# EasyEDA Pro project final.epro

# Schematic final
Board Name: final; Create Date: 2025-06-27; Page Name: P1; Project Name: mousring; Schematic Name: final; Update Date: 2025-06-27; Company: EasyEDA.com; Page Size: A4; Version: V1.0
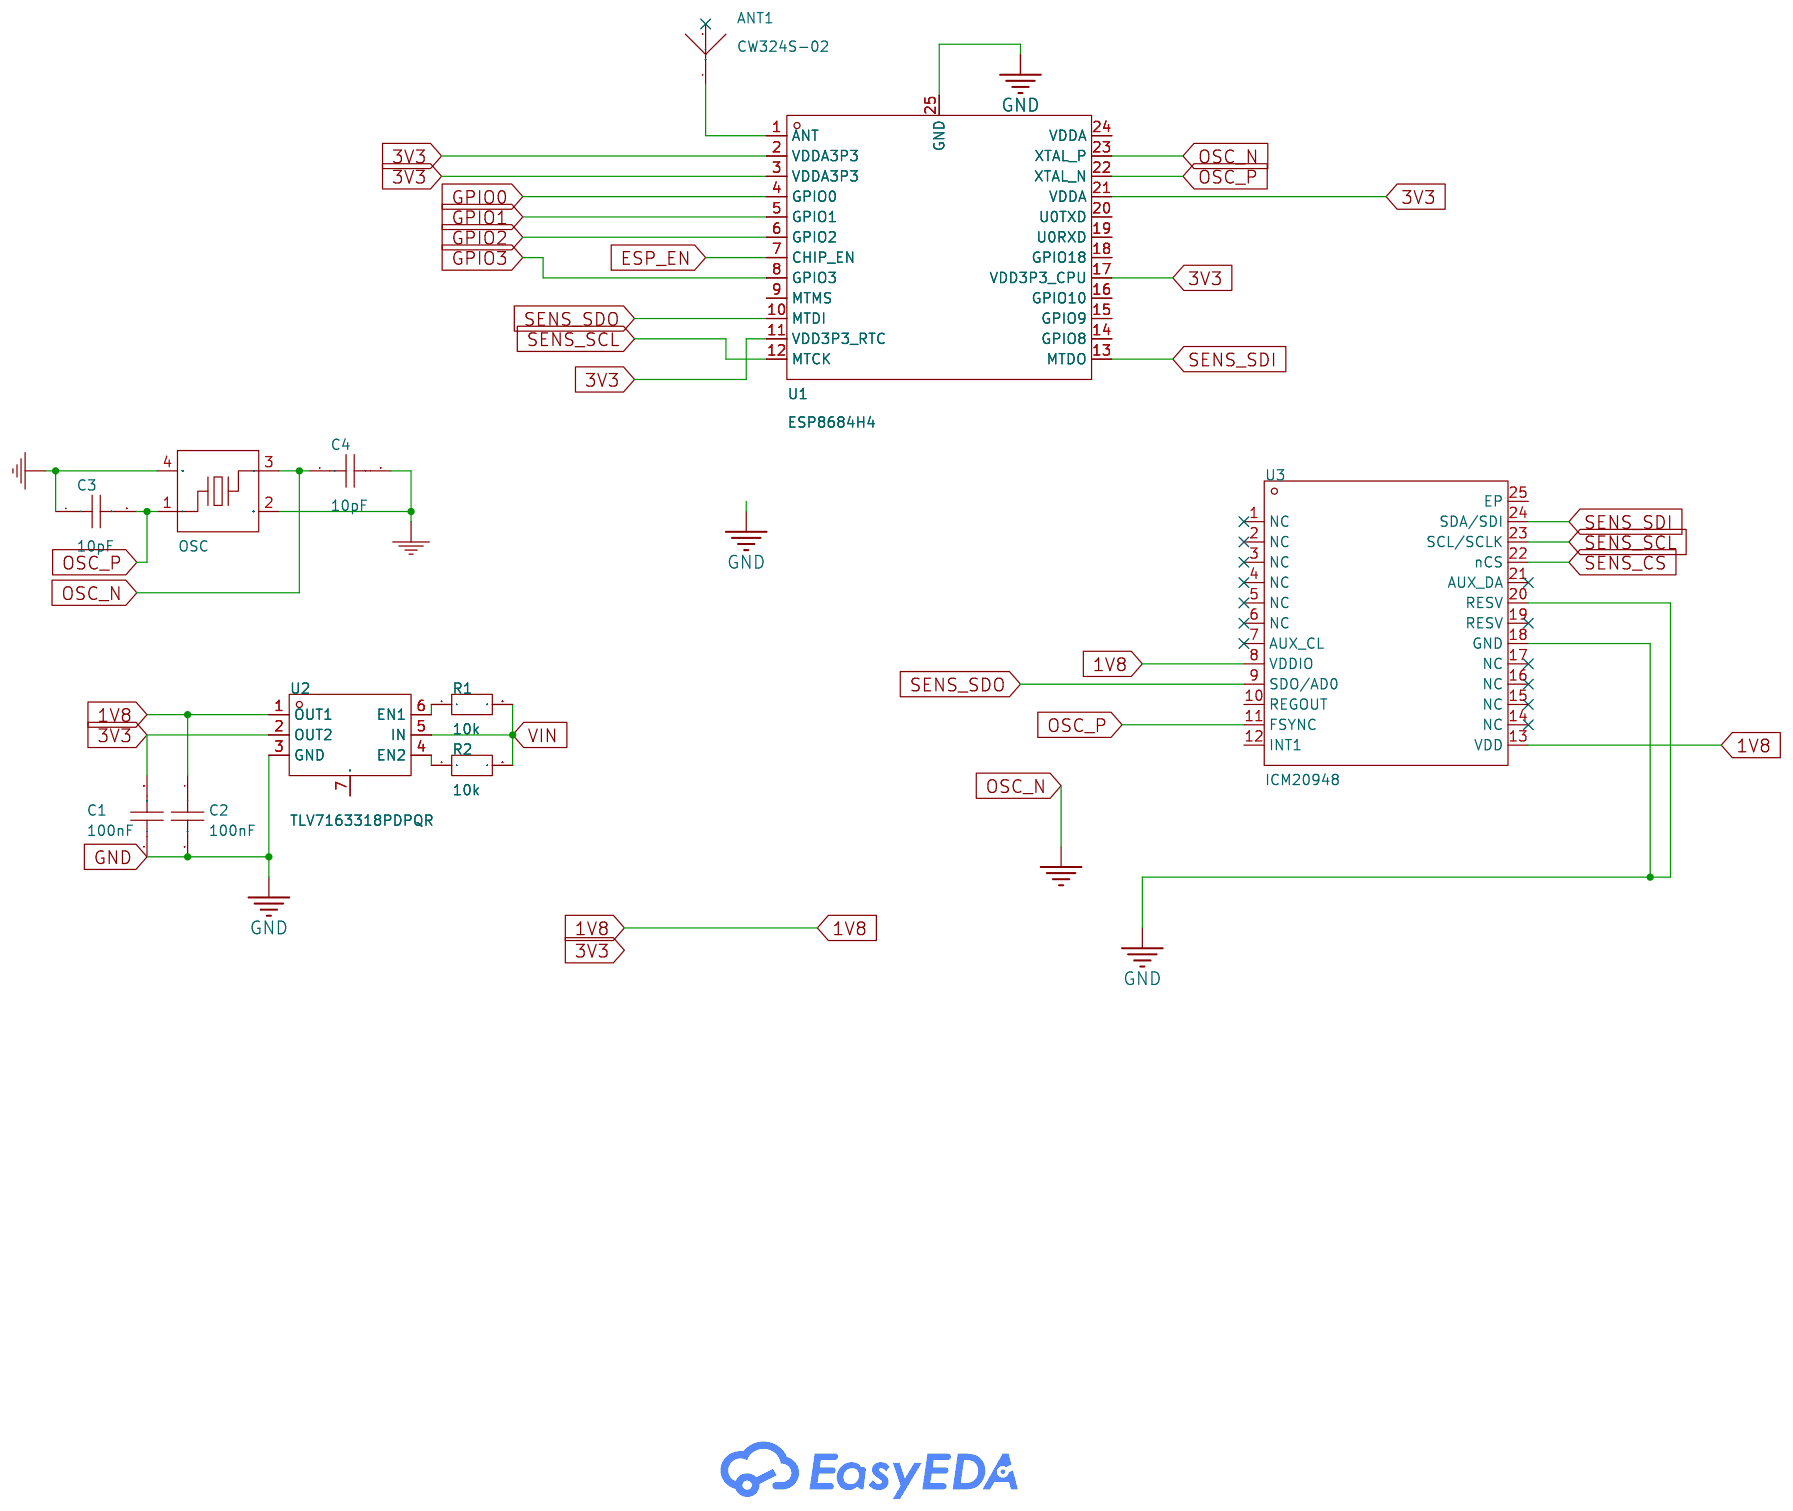
[diagram p0: schematic sheet]

## Parts
ANT1  CW324S-02  [ANT-SMD_L3.2-W1.6_CW324S-01]
C1  100nF  [C0201]
C2  100nF  [C0201]
C3  10pF  [C0201]
C4  10pF  [C0201]
R1  10k  [R0201]
R2  10k  [R0201]
U1  ESP8684H4  [QFN-24_L4.0-W4.0-P0.50-TL-EP2.8]
U2  TLV7163318PDPQR  [XDFN-6_L1.2-W1.2-P0.40-BL-EP]
U3  ICM20948  [QFN-24_L3.0-W3.0-P0.40-BL-EP]
X1  OSC  [CRYSTAL-SMD_4P-L1.6-W1.2-BL]

## Library data of the parts
ANT1 = CW324S-02: LCSC Part Name: LXC(连兴创)陶瓷SMT天线-CW324S; Supplier Part: C42379500; Manufacturer: LXC(连兴创); Datasheet: https://atta.szlcsc.com/upload/public/pdf/source/20241122/8212D1C9576862F7E470A8A9A6B7A996.pdf; Supplier: LCSC
C1-C4 = C0201X5R104K100NTA: Capacitance:100nF Tolerance:±10% Tolerance:±10% Voltage Rating:10V Temperature Coefficient:X5R; LCSC Part Name: 100nF ±10% 10V; Supplier Part: C115574; Manufacturer: EYANG(宇阳科技); Supplier Footprint: 0201; JLCPCB Part Class: Extended Part; Datasheet: https://atta.szlcsc.com/upload/public/pdf/source/20190320/C377537_BBE5FC54ADCBA21EA65467531FECB98A.pdf; Supplier: LCSC; Tolerance: ±10%; Voltage Rating: 10V; Temperature Coefficient: X5R
R1 R2 = CRCW0201174KFKED: Type:Thick Film Resistor Resistance:174kΩ Tolerance:±1% Tolerance:±1% Power(Watts):50mW Temperature Coefficient:±100ppm/℃ Temperature Coefficient:±100ppm/℃ Operating Temperature:-55℃~+155℃ Operating Temperature:-55℃~+155℃; LCSC Part Name: 厚膜电阻 174kΩ ±1% 50mW; Supplier Part: C4009760; Manufacturer: VISHAY(威世); Supplier Footprint: 0201; JLCPCB Part Class: Extended Part; Datasheet: https://atta.szlcsc.com/upload/public/pdf/source/20231212/8E026970A8D15C23141671AA58BF5AA2.pdf; Supplier: LCSC; Type: Thick Film Resistor; Tolerance: ±1%; Power(Watts): 50mW; Temperature Coefficient: ±100ppm/℃; Operating Temperature: -55℃~+155℃
U1 = ESP8684H4: Frequency Range:2.412GHz~2.484GHz Frequency Range:2.412GHz~2.484GHz Interface:ADC；SPI；I2C；PWM；UART Voltage - Supply:3V~3.6V Voltage - Supply:3V~3.6V Applications:WiFi；Bluetooth Output Power:21.5dBm Data Rate:72.2Mbps Current Of Transmitting:370mA Sensitiv; Supplier Part: C3013914; Manufacturer: ESPRESSIF(乐鑫); Supplier Footprint: SMD; JLCPCB Part Class: Extended Part; Datasheet: https://atta.szlcsc.com/upload/public/pdf/source/20241030/0403F47588ED3144E213BDA8AAC70CC1.pdf; Supplier: LCSC; Frequency Range: 2.412GHz~2.484GHz; Interface: ADC；SPI；I2C；PWM；UART; Voltage - Supply: 3V~3.6V; Applications: WiFi；Bluetooth; Output Power: 21.5dBm; Data Rate: 72.2Mbps; Current Of Transmitting: 370mA; Sensitivity: -99dBm; Receive Current: 65mA; Typical Application Frequency: 2.4GHz; Operating Temperature: -40℃~+105℃
U2 = TLV7163318PDPQR: Output Type:Fixed Maximum Input Voltage:5.5V Output Voltage:1.8V；3.3V Output Voltage:1.8V；3.3V Output Current:150mA Dropout Voltage:580mV@(150mA)；420mV@(150mA) standby current:75uA Feature:ESD Protection；Surge Protection；Automatic Discharge Function；Therm; LCSC Part Name: 具有使能功能的 150mA、双通道低压降稳压器; Supplier Part: C2859836; Manufacturer: TI(德州仪器); Supplier Footprint: X2SON-6(1.2x1.2); JLCPCB Part Class: Extended Part; Datasheet: https://www.ti.com/cn/lit/gpn/tlv716p; Supplier: LCSC; Output Type: Fixed; Maximum Input Voltage: 5.5V; Output Voltage: 1.8V；3.3V; Output Current: 150mA; Dropout Voltage: 580mV@(150mA)；420mV@(150mA); standby current: 75uA; Feature: ESD Protection；Surge Protection；Automatic Discharge Function；Thermal Protection(TSD)；Under-voltage Lockout；Overcurrent Protection(OCP)；With ability；Anti-Siphon; Operating Temperature: -40℃~+125℃@(Tj); Output Polarity: Positive electrode; Number of Outputs: 2
U3 = ICM20948: Supplier Part: C2683596; Supplier Footprint: DFN-24-EP(3.0x3.0); JLCPCB Part Class: Extended Part; Supplier: LCSC
X1 = 40MHz: Supplier: LCSC; Supplier Part: C7301927; Manufacturer: SCTF(星通时频); Manufacturer Part: SX0B40.000F1010F30; JLCPCB Part Class: Extended Part; nameAlias: Value; Contributor: lcsc; spicePre: X; spiceSymbolName: SX0B40.000F1010F30

## Nets
1V8: C2.1 U2.1(OUT1) U3.8(VDDIO) U3.13(VDD)
3V3: C1.2 U1.2(VDDA3P3) U1.3(VDDA3P3) U1.11(VDD3P3_RTC) U1.17(VDD3P3_CPU) U1.21(VDDA) U2.2(OUT2)
GND: C1.1 C2.2 C3.1 C4.2 U1.25(GND) U2.3(GND) U3.18(GND) U3.20(RESV) X1.2(GND) X1.4(GND)
VIN: R1.2 R2.2 U2.5(IN)
ESP_EN: U1.7(CHIP_EN)
GPIO0: U1.4(GPIO0)
GPIO1: U1.5(GPIO1)
GPIO2: U1.6(GPIO2)
GPIO3: U1.8(GPIO3)
OSC_N: C4.1 U1.23(XTAL_P) X1.3
OSC_P: C3.2 U1.22(XTAL_N) U3.11(FSYNC) X1.1
SENS_CS: U3.22(nCS)
SENS_SCL: U1.12(MTCK) U3.23(SCL/SCLK)
SENS_SDI: U1.13(MTDO) U3.24(SDA/SDI)
SENS_SDO: U1.10(MTDI) U3.9(SDO/AD0)
$1N3310: ANT1.1(ANT) U1.1(ANT)
$1N5722: R2.1 U2.4(EN2)
$1N5750: R1.1 U2.6(EN1)

Not connected (* = marked no-connect by the designer): ANT1 2*; U1 9(MTMS) 14(GPIO8) 15(GPIO9) 16(GPIO10) 18(GPIO18) 19(U0RXD) 20(U0TXD) 24(VDDA); U2 7(EP); U3 1(NC)* 2(NC)* 3(NC)* 4(NC)* 5(NC)* 6(NC)* 7(AUX_CL)* 10(REGOUT) 12(INT1) 14(NC)* 15(NC)* 16(NC)* 17(NC)* 19(RESV)* 21(AUX_DA)* 25(EP)

# Board PCB8
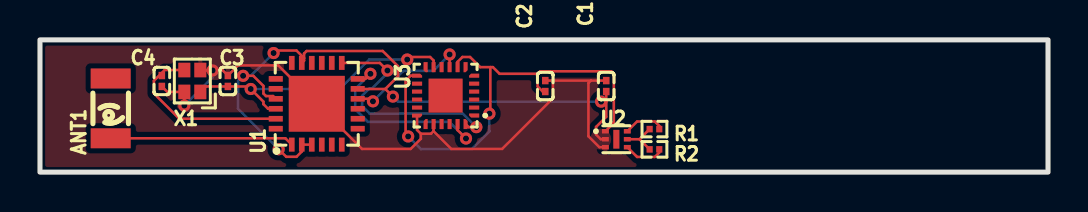
[diagram p1: board, top side]
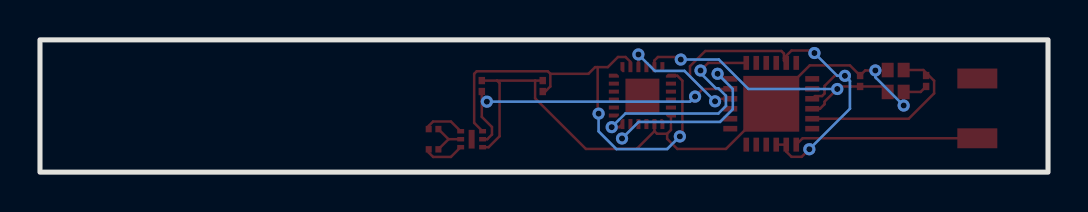
[diagram p2: board, bottom side, seen from below]

Outline 50.42 x 6.64 mm; copper layers: Top Layer, Bottom Layer. Coordinates in mm from the lower left corner of the outline.
Outline path: rectangle 0,0 50.42,6.64
Stack: Top Layer 0.035mm / Dielectric1 1.51mm FR4 er 4.5 / Bottom Layer 0.035mm

## Design rules (mm)
template: Custom Config
spacing copperThickness1oz (default): track to track 0.102, other pairs 0.152 to 0.3
spacing copperThickness2oz: track to track 0.203, other pairs 0.152 to 0.3
track width copperThickness1oz (default): min 0.127, default 0.127, max 2.54
track width copperThickness2oz: min 0.203, default 0.254, max 2.54
differential pair differentialPair (default): width min 0.127, default 0.254, max 2.54; gap min 0.152, default 0.152
via viaSize (default): diameter min 0.5, default 0.61, max 10; hole min 0.3, default 0.305, max 6.3

## Placement (name value [footprint] x y rotation side)
ANT1  CW324S-02  [ANT-SMD_L3.2-W1.6_CW324S-01]  3.54 3.2 90 top
C1  100nF  [C0201]  28.32 4.32 270 top
C2  100nF  [C0201]  25.27 4.32 90 top
C3  10pF  [C0201]  9.4 4.57 270 top
C4  10pF  [C0201]  6.1 4.57 270 top
R1  10k  [R0201]  30.73 2.16 180 top
R2  10k  [R0201]  30.73 1.14 180 top
U1  ESP8684H4  [QFN-24_L4.0-W4.0-P0.50-TL-EP2.8]  13.84 3.43 90 top
U2  TLV7163318PDPQR  [XDFN-6_L1.2-W1.2-P0.40-BL-EP]  28.83 1.65 270 top
U3  ICM20948  [QFN-24_L3.0-W3.0-P0.40-BL-EP]  20.29 3.84 90 top
X1  OSC  [CRYSTAL-SMD_4P-L1.6-W1.2-BL]  7.62 4.57 90 top

## Footprints (pads in the part's own frame, mm; a bottom-side part is the same pattern mirrored in y, then rotated)
ANT-SMD_L3.2-W1.6_CW324S-01
  rect 1x2 smd: 1(-1.5,0) 2(1.5,0)
C0201
  rect 0.368x0.324 smd: 1(-0.275,0) 2(0.275,0)
CRYSTAL-SMD_4P-L1.6-W1.2-BL
  rect 0.73x0.6 smd: 1(-0.55,-0.4) 2(0.55,-0.4) 3(0.55,0.4) 4(-0.55,0.4)
QFN-24_L3.0-W3.0-P0.40-BL-EP
  custom 0.2x0.506 smd: 1(-1,-1.427) 6(1,-1.427) 13(1,1.427) 18(-1,1.427)
  rect 0.2x0.505 smd: 2(-0.6,-1.427) 3(-0.2,-1.427) 4(0.2,-1.427) 5(0.6,-1.427) 14(0.6,1.427) 15(0.2,1.427) 16(-0.2,1.427) 17(-0.6,1.427)
  custom 0.506x0.2 smd: 7(1.427,-1) 12(1.427,1) 19(-1.427,1) 24(-1.427,-1)
  rect 0.505x0.2 smd: 8(1.427,-0.6) 9(1.427,-0.2) 10(1.427,0.2) 11(1.427,0.6) 20(-1.427,0.6) 21(-1.427,0.2) 22(-1.427,-0.2) 23(-1.427,-0.6)
  rect 1.7x1.7 smd: 25(0,0)
QFN-24_L4.0-W4.0-P0.50-TL-EP2.8
  rect 0.7x0.28 smd: 1(-2.05,1.25) 2(-2.05,0.75) 3(-2.05,0.25) 4(-2.05,-0.25) 5(-2.05,-0.75) 6(-2.05,-1.25) 13(2.05,-1.25) 14(2.05,-0.75) 15(2.05,-0.25) 16(2.05,0.25) 17(2.05,0.75) 18(2.05,1.25)
  rect 0.28x0.7 smd: 7(-1.25,-2.05) 8(-0.75,-2.05) 9(-0.25,-2.05) 10(0.25,-2.05) 11(0.75,-2.05) 12(1.25,-2.05) 19(1.25,2.05) 20(0.75,2.05) 21(0.25,2.05) 22(-0.25,2.05) 23(-0.75,2.05) 24(-1.25,2.05)
  rect 2.8x2.8 smd: 25(0,0)
R0201
  rect 0.303x0.324 smd: 1(-0.241,0) 2(0.241,0)
XDFN-6_L1.2-W1.2-P0.40-BL-EP
  rect 0.224x0.345 smd: 1(-0.4,-0.547) 2(0,-0.547) 3(0.4,-0.547) 4(0.4,0.547) 5(0,0.547) 6(-0.4,0.547)
  rect 0.94x0.3 smd: 7(0,0)

## Nets
As in the schematic.

Pads without a net: ANT1 2; U1 9 14 15 16 18 19 20 24; U2 7; U3 1 2 3 4 5 6 7 10 12 14 15 16 17 19 21 25

## Via types
v1: diameter 0.61, hole 0.305, Top Layer to Bottom Layer, 17 vias

## Routing (per net, layer and track width the routed paths; a pad name or vN(x,y) marks a point on that pad's centre or on a via; arc(x,y) is an arc through that point)
1V8: length 24.3
  Top Layer w0.127: v1(18.41,1.79) 18.29,1.92 18.29,4.59 18.54,4.84 U3.13 ; 22.53,5.27 22.65,5.27 22.99,4.93 24.89,4.93 ; 22.53,5.27 22.53,2.98 v1(22.48,2.93) ; 22.53,5.27 22.02,5.27 21.51,5.78 21.13,5.78 20.89,5.53 U3.8 ; C2.1 25.15,4.04 24.89,4.3 24.89,4.93 ; 24.89,4.93 25.02,5.06 28.57,5.06 28.7,4.93 28.7,2.47 U2.1
  Bottom Layer w0.127: v1(18.41,1.79) 19.05,1.16 21.59,1.16 22.48,2.05 v1(22.48,2.93)
3V3: length 35.6
  Top Layer w0.127: 13.21,5.72 13.21,5.95 13.34,6.08 17.15,6.08 17.91,5.31 17.91,4.81 17.27,4.17 ; 13.21,5.72 12.83,6.1 11.81,6.1 v1(11.68,5.97) ; 13.21,5.72 13.21,5.59 U1.17 ; U2.2 28.05,1.65 27.81,1.88 27.81,2.27 28.32,2.77 28.32,3.54 ; U1.3 U1.2 13.09,1.03 12.83,0.77 12.32,0.77 v1(11.94,1.15) ; U1.11 15.9,4.17 17.27,4.17 ; 28.32,3.54 v1(28.07,3.54) ; 28.32,3.54 C1.2 ; U1.21 11.66,3.82 11.3,3.82 11.18,3.94 11.18,4.32 10.67,4.83 v1(10.16,4.83) ; 17.27,4.17 v1(17.65,3.79)
  Bottom Layer w0.127: v1(28.07,3.54) 17.91,3.54 v1(17.65,3.79) ; v1(11.68,5.97) 10.54,4.83 v1(10.16,4.83) 9.91,4.58 9.91,3.18 v1(11.94,1.15)
GND: length 35.1
  Top Layer w0.127: U2.3 27.98,1.25 27.43,1.8 27.43,4.47 27.56,4.59 ; 27.56,4.59 25.65,4.59 ; 27.56,4.59 C1.1 ; 25.65,4.59 25.65,3.7 23.11,1.16 20.57,1.16 19.69,2.05 ; 25.65,4.59 C2.2 ; 19.05,1.93 18.86,2.11 U3.18 ; 19.05,1.93 19.05,1.67 18.54,1.16 16.11,1.16 U1.25 11.92,5.35 9.91,5.35 C3.1 9.14,5.1 v1(8.64,5.1) 8.04,5.1 X1.2 ; 19.05,1.93 19.56,1.93 19.69,2.05 ; 19.69,2.05 19.69,2.41 ; v1(7.22,3.34) X1.4 6.37,4.02 C4.2
  Bottom Layer w0.127: v1(7.22,3.34) 8.64,4.76 v1(8.64,5.1)
VIN: length 2
  Top Layer w0.127: 29.98,1.65 R1.2 ; 29.98,1.65 R2.2 ; 29.98,1.65 U2.5
OSC_N: length 9.1
  Top Layer w0.127: 6.08,4.97 6.08,4.86 C4.1 ; 6.08,4.97 6.24,5.12 X1.3 ; 6.08,4.97 5.7,4.58 5.7,3.95 6.97,2.68 U1.23
OSC_P: length 14.6
  Top Layer w0.127: U1.22 11.41,3.18 11.18,3.41 11.18,3.54 10.41,4.3 C3.2 8.3,4.3 X1.1 ; U3.11 19.69,5.6 19.51,5.78 18.5,5.78 v1(18.37,5.65)
  Bottom Layer w0.127: v1(18.37,5.65) 16.46,5.65 14.99,4.17 v1(10.54,4.17)
SENS_SCL: length 9.9
  Top Layer w0.127: U3.23 20.89,2.11 v1(21.31,1.69) ; U1.12 16.27,4.68 v1(16.53,4.93)
  Bottom Layer w0.127: v1(16.53,4.93) 15.77,4.17 15.77,3.16 16.4,2.52 20.47,2.52 v1(21.31,1.69)
SENS_SDI: length 11.6
  Top Layer w0.127: U3.24 21.44,2.26 v1(21.82,2.26) ; v1(17.38,5.1) 17,5.48 U1.13
  Bottom Layer w0.127: v1(21.82,2.26) 21.14,2.94 16.49,2.94 16.11,3.32 16.11,3.83 16.49,4.21 16.62,4.21 17.38,4.97 v1(17.38,5.1)
SENS_SDO: length 6.3
  Top Layer w0.127: v1(20.49,5.9) U3.9 ; v1(16.65,3.55) 16.53,3.68 U1.10
  Bottom Layer w0.127: v1(16.65,3.55) 18.18,5.08 19.66,5.08 v1(20.49,5.9)
$1N3310: length 9.2
  Top Layer w0.127: ANT1.1 12.28,1.7 U1.1
$1N5722: length 2.1
  Top Layer w0.127: R2.1 30.98,0.98 30.75,0.76 29.87,0.76 U2.4
$1N5750: length 2.1
  Top Layer w0.127: U2.6 29.87,2.54 30.75,2.54 30.98,2.32 R1.1

## Copper pours and planes (outline as drawn; the poured copper is in the pictures)
GND on Top Layer: 0.25,6.35 37.08,6.35 37.08,0.25 0.25,0.25
